# Altium schematic sheet Power.SchDoc
size B; SheetNumber: 2; SheetTotal: 2
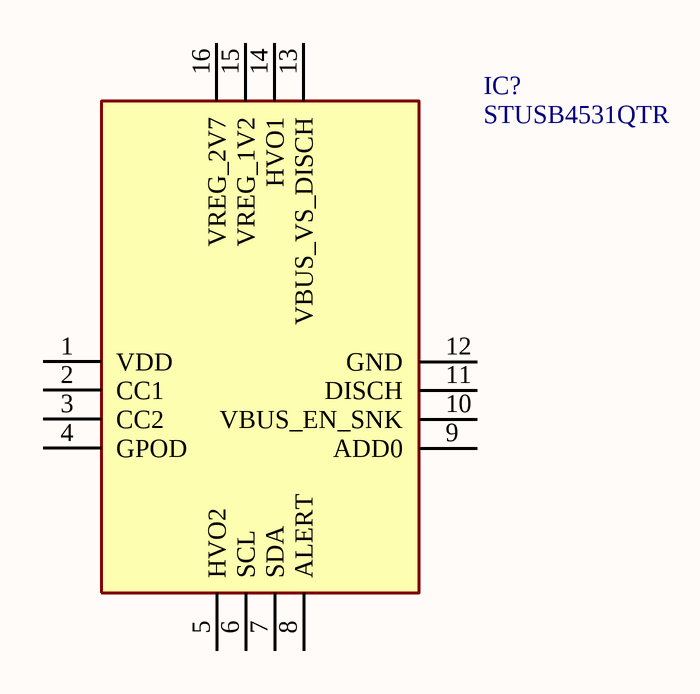
[diagram p0: Power.SchDoc]

## Parts
IC?  STUSB4531QTR  [QFN50P300X300X65-16N-D]

## Nets

Not connected (* = marked no-connect by the designer): IC? 1(VDD) 2(CC1) 3(CC2) 4(GPOD) 5(HVO2) 6(SCL) 7(SDA) 8(ALERT) 9(ADD0) 10(VBUS_EN_SNK) 11(DISCH) 12(GND) 13(VBUS_VS_DISCH) 14(HVO1) 15(VREG_1V2) 16(VREG_2V7)

## Library data of the parts
IC? = STUSB4531QTR: Integrated Circuit; Manufacturer_Name: STMicroelectronics; Datasheet Link: https://www.st.com/resource/en/datasheet/stusb4531.pdf; Height: 0.65mm; Manufacturer_Part_Number: STUSB4531QTR